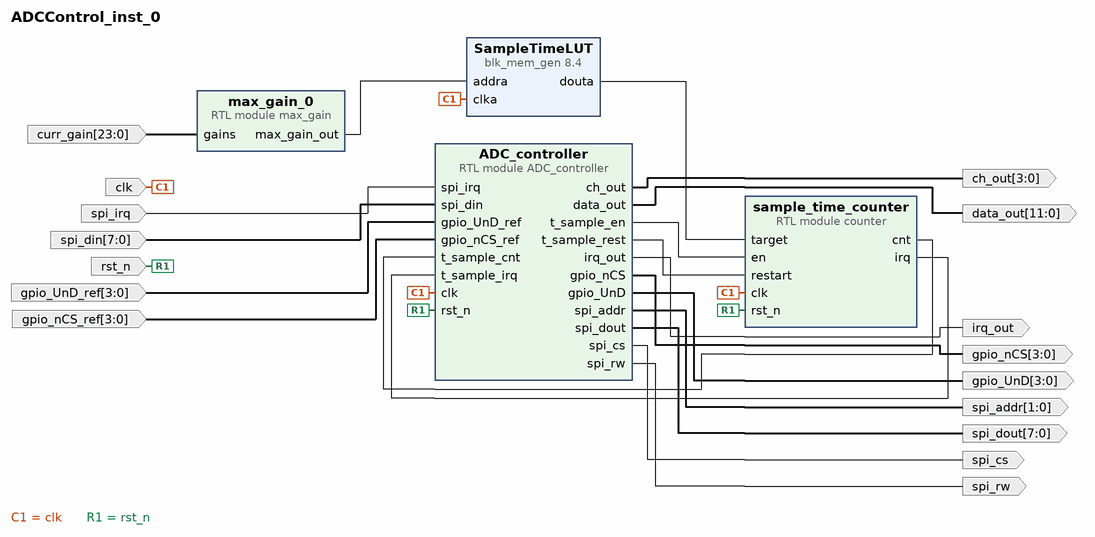
[diagram p0: block diagram of the top level]
# Vivado block design ADCControl_inst_0, xczu3eg-sbva484-1-i, Vivado 2020.2
create_bd_design ADCControl_inst_0

create_bd_port -dir O -from 3 -to 0 ch_out
create_bd_port -dir I -type clk clk
create_bd_port -dir I -from 23 -to 0 curr_gain
create_bd_port -dir O -from 11 -to 0 data_out
create_bd_port -dir O -from 3 -to 0 gpio_UnD
create_bd_port -dir I -from 3 -to 0 gpio_UnD_ref
create_bd_port -dir O -from 3 -to 0 gpio_nCS
create_bd_port -dir I -from 3 -to 0 gpio_nCS_ref
create_bd_port -dir O irq_out
create_bd_port -dir I -type rst rst_n
create_bd_port -dir O -from 1 -to 0 spi_addr
create_bd_port -dir O spi_cs
create_bd_port -dir I -from 7 -to 0 spi_din
create_bd_port -dir O -from 7 -to 0 spi_dout
create_bd_port -dir I spi_irq
create_bd_port -dir O spi_rw

create_bd_cell -type ip -vlnv xilinx.com:ip:blk_mem_gen:8.4 SampleTimeLUT
set_property -dict [list \
  CONFIG.Coe_File ../../../../../../../../../../src/sample_time_lut_data.coe \
  CONFIG.Enable_32bit_Address false \
  CONFIG.Enable_A Always_Enabled \
  CONFIG.Load_Init_File true \
  CONFIG.Memory_Type Single_Port_ROM \
  CONFIG.Port_A_Write_Rate 0 \
  CONFIG.Register_PortA_Output_of_Memory_Primitives true \
  CONFIG.Use_RSTA_Pin false \
  CONFIG.Write_Depth_A 64 \
  CONFIG.Write_Width_A 20 \
  CONFIG.use_bram_block Stand_Alone \
] [get_bd_cells SampleTimeLUT]
create_bd_cell -type module -reference counter sample_time_counter
set_property -dict {CONFIG.n_bits 20} [get_bd_cells sample_time_counter]
create_bd_cell -type module -reference max_gain max_gain_0
create_bd_cell -type module -reference ADC_controller ADC_controller

# ---- connections ----

connect_bd_net -net clk_0_1 [get_bd_ports clk] [get_bd_pins SampleTimeLUT/clka] [get_bd_pins sample_time_counter/clk] [get_bd_pins ADC_controller/clk]
connect_bd_net -net rst_n_0_1 [get_bd_ports rst_n] [get_bd_pins sample_time_counter/rst_n] [get_bd_pins ADC_controller/rst_n]
connect_bd_net [get_bd_ports spi_irq] [get_bd_pins ADC_controller/spi_irq]
connect_bd_net [get_bd_ports spi_din] [get_bd_pins ADC_controller/spi_din]
connect_bd_net [get_bd_ports gpio_UnD_ref] [get_bd_pins ADC_controller/gpio_UnD_ref]
connect_bd_net [get_bd_ports gpio_nCS_ref] [get_bd_pins ADC_controller/gpio_nCS_ref]
connect_bd_net -net ADC_controller_0_irq_out [get_bd_pins ADC_controller/irq_out] [get_bd_ports irq_out]
connect_bd_net -net ADC_controller_0_ch_out [get_bd_pins ADC_controller/ch_out] [get_bd_ports ch_out]
connect_bd_net -net ADC_controller_0_data_out [get_bd_pins ADC_controller/data_out] [get_bd_ports data_out]
connect_bd_net -net ADC_controller_0_gpio_nCS [get_bd_pins ADC_controller/gpio_nCS] [get_bd_ports gpio_nCS]
connect_bd_net -net ADC_controller_0_gpio_UnD [get_bd_pins ADC_controller/gpio_UnD] [get_bd_ports gpio_UnD]
connect_bd_net -net ADC_controller_0_spi_dout [get_bd_pins ADC_controller/spi_dout] [get_bd_ports spi_dout]
connect_bd_net -net ADC_controller_0_spi_addr [get_bd_pins ADC_controller/spi_addr] [get_bd_ports spi_addr]
connect_bd_net -net ADC_controller_0_spi_rw [get_bd_pins ADC_controller/spi_rw] [get_bd_ports spi_rw]
connect_bd_net -net ADC_controller_0_spi_cs [get_bd_pins ADC_controller/spi_cs] [get_bd_ports spi_cs]
connect_bd_net [get_bd_pins ADC_controller/t_sample_en] [get_bd_pins sample_time_counter/en]
connect_bd_net [get_bd_pins sample_time_counter/cnt] [get_bd_pins ADC_controller/t_sample_cnt]
connect_bd_net [get_bd_pins ADC_controller/t_sample_rest] [get_bd_pins sample_time_counter/restart]
connect_bd_net [get_bd_pins sample_time_counter/irq] [get_bd_pins ADC_controller/t_sample_irq]
connect_bd_net [get_bd_pins SampleTimeLUT/douta] [get_bd_pins sample_time_counter/target]
connect_bd_net [get_bd_pins max_gain_0/max_gain_out] [get_bd_pins SampleTimeLUT/addra]
connect_bd_net [get_bd_ports curr_gain] [get_bd_pins max_gain_0/gains]

validate_bd_design
save_bd_design
